# Altium schematic sheet 02-mcu0.SchDoc: MCU
size Letter; DrawnBy: J. Brinton; Engineer: J. Brinton; Revision: 1; SheetNumber: 2; SheetTotal: 14
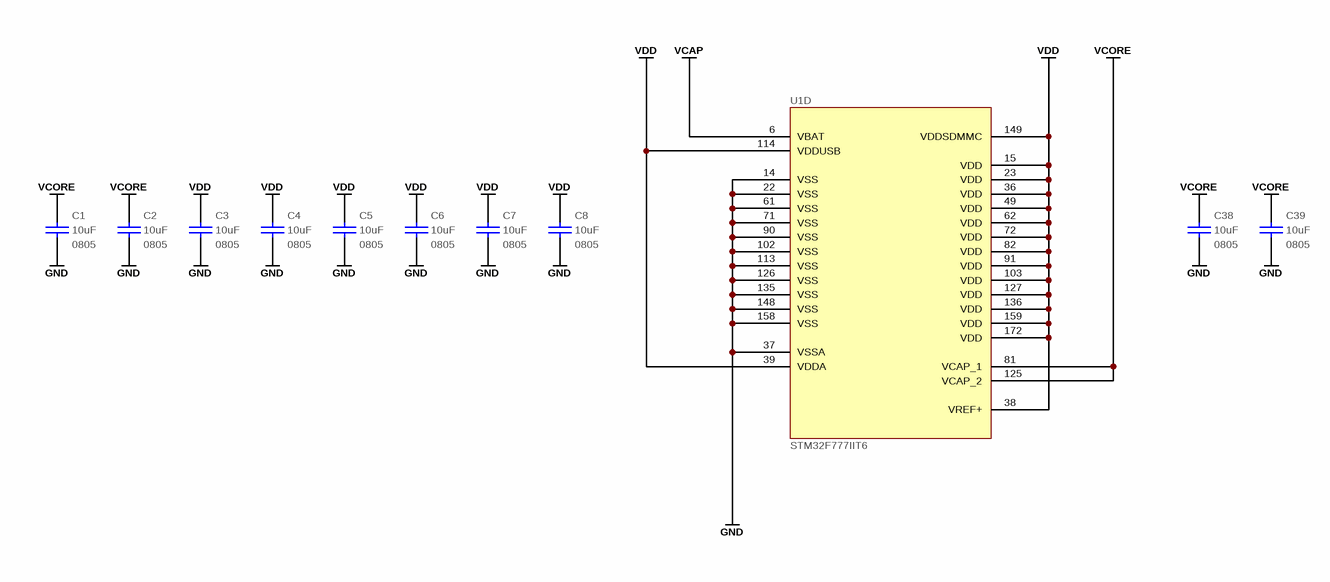
[diagram p0: 02-mcu0.SchDoc]

## Parts
C1  value 10uF  Package: 0805  [CAPC200X125X145L45N]  (hidden comment: CL21B106KOQNNNE)
C2  value 10uF  Package: 0805  [CAPC200X125X145L45N]  (hidden comment: CL21B106KOQNNNE)
C3  value 10uF  Package: 0805  [CAPC200X125X145L45N]  (hidden comment: CL21B106KOQNNNE)
C4  value 10uF  Package: 0805  [CAPC200X125X145L45N]  (hidden comment: CL21B106KOQNNNE)
C5  value 10uF  Package: 0805  [CAPC200X125X145L45N]  (hidden comment: CL21B106KOQNNNE)
C6  value 10uF  Package: 0805  [CAPC200X125X145L45N]  (hidden comment: CL21B106KOQNNNE)
C7  value 10uF  Package: 0805  [CAPC200X125X145L45N]  (hidden comment: CL21B106KOQNNNE)
C8  value 10uF  Package: 0805  [CAPC200X125X145L45N]  (hidden comment: CL21B106KOQNNNE)
C38  value 10uF  Package: 0805  [CAPC200X125X145L45N]  (hidden comment: CL21B106KOQNNNE)
C39  value 10uF  Package: 0805  [CAPC200X125X145L45N]  (hidden comment: CL21B106KOQNNNE)
U1  STM32F777IIT6  [TSQFP50P2600X2600X160-176N]  (part D of 4)

## Nets
GND: C1.2 C2.2 C3.2 C4.2 C5.2 C6.2 C7.2 C8.2 C38.2 C39.2 U1.14(VSS) U1.22(VSS) U1.37(VSSA) U1.61(VSS) U1.71(VSS) U1.90(VSS) U1.102(VSS) U1.113(VSS) U1.126(VSS) U1.135(VSS) U1.148(VSS) U1.158(VSS)
VCAP: U1.6(VBAT)
VCORE: C1.1 C2.1 C38.1 C39.1 U1.81(VCAP_1) U1.125(VCAP_2)
VDD: C3.1 C4.1 C5.1 C6.1 C7.1 C8.1 U1.15(VDD) U1.23(VDD) U1.36(VDD) U1.38(VREF+) U1.39(VDDA) U1.49(VDD) U1.62(VDD) U1.72(VDD) U1.82(VDD) U1.91(VDD) U1.103(VDD) U1.114(VDDUSB) U1.127(VDD) U1.136(VDD) U1.149(VDDSDMMC) U1.159(VDD) U1.172(VDD)

## Notes on the sheet
- Designed By:
- Title
- Engineer
- Revision
- Drawn By
- Date
- Sheet
- of

## Library data of the parts
C1-C8 C38 C39 = LMK212B7106KG: Ceramic Capacitor 10uF ±10% 16V X7R 0805; Manufacturer: Samsung; Tr: -55:105; Manufacturer P/N: CL21B106KOQNNNE; Tolerance: ±10%; Voltage: 16V
U1 = STM32F777IIT: Microcontroller; Manufacturer: STMicroelectronics; Manufacturer P/N: STM32F777IIT6